# Altium project PCB_Lopta.PrjPcb
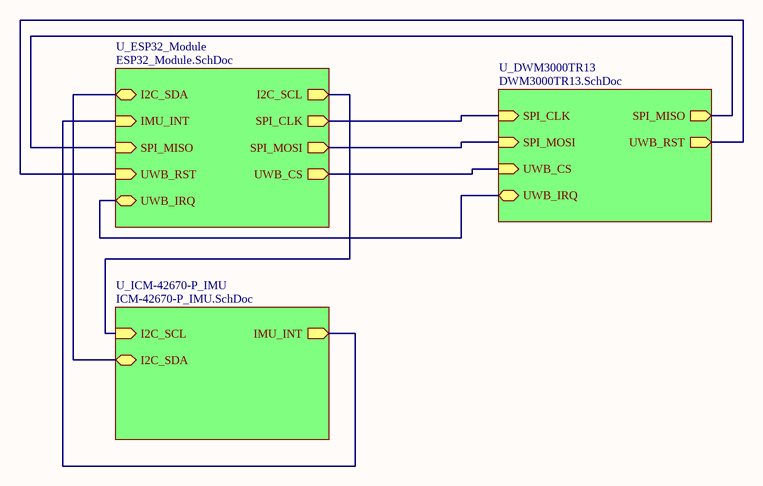
[diagram p0: Main.SchDoc]
4 sheets, 26 parts. Net scope: hierarchical (ports join the sheet entries above them; power ports are global).
Board file: PCB_Ball.PcbDoc
Sheets:
  Main.SchDoc
    U_ESP32_Module = ESP32_Module.SchDoc
    U_DWM3000TR13 = DWM3000TR13.SchDoc
    U_ICM-42670-P_IMU = ICM-42670-P_IMU.SchDoc

## Sheet Main.SchDoc
size A; SheetNumber: 1; SheetTotal: 4

### Sub-sheets
U_DWM3000TR13 = DWM3000TR13.SchDoc: SPI_CLK (in), SPI_MISO (out), SPI_MOSI (in), UWB_CS (in), UWB_RST (out), UWB_IRQ (bidir)
U_ESP32_Module = ESP32_Module.SchDoc: I2C_SCL (out), I2C_SDA (bidir), IMU_INT (in), SPI_CLK (out), SPI_MISO (in), SPI_MOSI (out), UWB_CS (out), UWB_RST (in), UWB_IRQ (bidir)
U_ICM-42670-P_IMU = ICM-42670-P_IMU.SchDoc: I2C_SCL (in), I2C_SDA (bidir), IMU_INT (out)

### Nets
NetMT1_4: sheet U_ESP32_Module/IMU_INT, sheet U_ICM-42670-P_IMU/IMU_INT
NetMT1_13: sheet U_ESP32_Module/I2C_SCL, sheet U_ICM-42670-P_IMU/I2C_SCL
NetMT1_14: sheet U_ESP32_Module/I2C_SDA, sheet U_ICM-42670-P_IMU/I2C_SDA
NetU1_6: sheet U_ESP32_Module/UWB_IRQ, sheet U_DWM3000TR13/UWB_IRQ
NetU1_12: sheet U_ESP32_Module/UWB_RST, sheet U_DWM3000TR13/UWB_RST
NetU1_29: sheet U_ESP32_Module/UWB_CS, sheet U_DWM3000TR13/UWB_CS
NetU1_30: sheet U_ESP32_Module/SPI_CLK, sheet U_DWM3000TR13/SPI_CLK
NetU1_31: sheet U_ESP32_Module/SPI_MISO, sheet U_DWM3000TR13/SPI_MISO
NetU1_37: sheet U_ESP32_Module/SPI_MOSI, sheet U_DWM3000TR13/SPI_MOSI

## Sheet ESP32_Module.SchDoc
size A; SheetNumber: 2; SheetTotal: 4
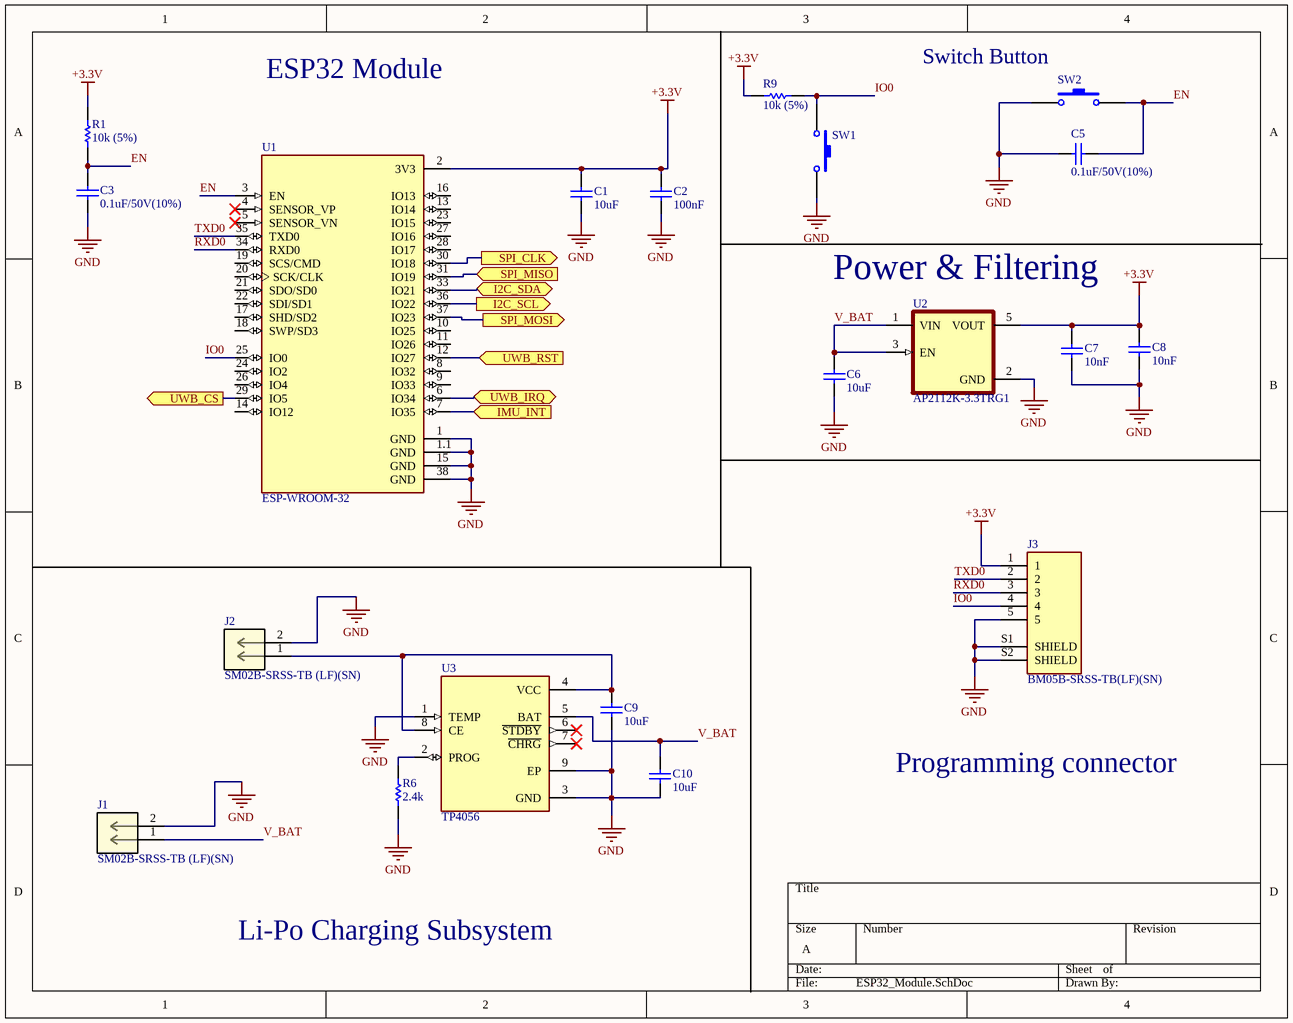
[diagram p1: ESP32_Module.SchDoc]

### Parts
C1  value 10uF  [CAPC1608X90]  (hidden comment: Cap)
C2  value 100nF  [CAPC1005X55N]  (hidden comment: Cap)
C3  value 0.1uF/50V(10%)  [CAPC2012X94N]  (hidden comment: Cap)
C5  value 0.1uF/50V(10%)  [CAPC2012X94N]  (hidden comment: Cap)
C6  value 10uF  [CAPC1608X90]  (hidden comment: Cap)
C7  value 10nF  [CAPC1608X87N]  (hidden comment: Cap)
C8  value 10nF  [CAPC1608X87N]  (hidden comment: Cap)
C9  value 10uF  [CAPC1608X90]  (hidden comment: Cap)
C10  value 10uF  [CAPC1608X90]  (hidden comment: Cap)
J1  SM02B-SRSS-TB (LF)(SN)  [CONN_SM02B-SRSS-TB_JST]
J2  SM02B-SRSS-TB (LF)(SN)  [CONN_SM02B-SRSS-TB_JST]
J3  BM05B-SRSS-TB(LF)(SN)  [JST_BM05B-SRSS-TB(LF)(SN)]
R1  value 10k (5%)  [RESC1005X40]  (hidden comment: Res1)
R6  value 2.4k  [RESC1005X40N]  (hidden comment: Res1)
R9  value 10k (5%)  [RESC1005X40]  (hidden comment: Res1)
SW1  SW-PB  [SW_TL3342F160QG]  (value not drawn)
SW2  SW-PB  [SW_TL3342F160QG]  (value not drawn)
U1  ESP-WROOM-32  [MODULE_ESP-WROOM-32]
U2  AP2112K-3.3TRG1  [SOT95P285X140-5N]
U3  TP4056  [SOP127P600X175-9N]

### Ports
I2C_SCL (out), I2C_SDA (bidir), IMU_INT (in), SPI_CLK (out), SPI_MISO (in), SPI_MOSI (out), UWB_CS (out), UWB_IRQ (bidir), UWB_RST (in)

### Nets
+3.3V: C1.2 C2.2 C7.2 C8.2 J3.1 R1.2 R9.2 U1.2(3V3) U2.5(VOUT)
GND: C1.1 C2.1 C3.1 C5.1 C6.1 C7.1 C8.1 C9.1 C10.1 J1.2 J2.2 J3.5 J3.S1(SHIELD) J3.S2(SHIELD) R6.1 SW1.2 SW2.1 U1.1(GND) U1.1.1(GND) U1.15(GND) U1.38(GND) U2.2(GND) U3.1(TEMP) U3.3(GND) U3.9(EP)
EN: C3.2 C5.2 R1.1 SW2.2 U1.3(EN)
IO0: J3.4 R9.1 SW1.1 U1.25(IO0)
RXD0: J3.3 U1.34(RXD0)
TXD0: J3.2 U1.35(TXD0)
V_BAT: C6.2 C10.2 J1.1 U2.1(VIN) U2.3(EN) U3.5(BAT)
NetC9_2: C9.2 J2.1 U3.4(VCC) U3.8(CE)
NetMT1_4: U1.7(IO35) ; port IMU_INT
NetMT1_13: U1.36(IO22) ; port I2C_SCL
NetMT1_14: U1.33(IO21) ; port I2C_SDA
NetR6_2: R6.2 U3.2(PROG)
NetU1_6: U1.6(IO34) ; port UWB_IRQ
NetU1_12: U1.12(IO27) ; port UWB_RST
NetU1_29: U1.29(IO5) ; port UWB_CS
NetU1_30: U1.30(IO18) ; port SPI_CLK
NetU1_31: U1.31(IO19) ; port SPI_MISO
NetU1_37: U1.37(IO23) ; port SPI_MOSI

Not connected (* = marked no-connect by the designer): U1 4(SENSOR_VP)* 5(SENSOR_VN)* 8(IO32) 9(IO33) 10(IO25) 11(IO26) 13(IO14) 14(IO12) 16(IO13) 17(SHD/SD2) 18(SWP/SD3) 19(SCS/CMD) 20(SCK/CLK) 21(SDO/SD0) 22(SDI/SD1) 23(IO15) 24(IO2) 26(IO4) 27(IO16) 28(IO17); U3 6(~{STDBY})* 7(~{CHRG})*

### Notes on the sheet
- ESP32 Module
- (near SW2) Switch Button
- Power & Filtering
- Programming connector
- Li-Po Charging Subsystem

### Library data of the parts
C1-C3 C5-C10 = Cap: Capacitor; Published: 8-Jun-2000; LatestRevisionDate: 17-Jul-2002; LatestRevisionNote: Re-released for DXP Platform.; PackageReference: RAD-0.3; Publisher: Altium Limited; PackageDescription: Radial Cap, Thru-Hole; 2 Leads; 0.3 in Pin Spacing
J1 J2 = SM02B-SRSS-TB LFSN: Description; Manufacturer_Name: JST; Copyright: Copyright (C) 2026 Ultra Librarian. All rights reserved.; Manufacturer_Part_Number: SM02B-SRSS-TB (LF)(SN); RefDes: RefDes; Type: Type
R1 R6 R9 = Res1: Resistor; Published: 8-Jun-2000; LatestRevisionDate: 17-Jul-2002; LatestRevisionNote: Re-released for DXP Platform.; PackageReference: AXIAL-0.3; Publisher: Altium Limited; PackageDescription: Axial Device, Thru-Hole; 2 Leads; 0.3 in Pin Spacing
SW1 SW2 = SW-PB: Switch; Published: 24-Mar-1999; LatestRevisionDate: 17-Jul-2002; LatestRevisionNote: Re-released for DXP Platform.; PackageReference: SPST-2; Publisher: Altium Limited; PackageDescription: Switch; 2 Leads
U1 = ESP-WROOM-32: Transceptor serie ESP-WROOM-32; Placa de evaluaciÃ³n 802.11 b/g/n (Wi-Fi, WiFi, WLAN), BluetoothÂ® Smart 4.x de bajo consumo (BLE); MF: Espressif Systems; SnapEDA_Link: https://www.snapeda.com/parts/ESP-WROOM-32/Espressif+Systems/view-part/?ref=snap; Package: Module Espressif Systems; Value: *; MP: ESP-WROOM-32; Check_prices: https://www.snapeda.com/parts/ESP-WROOM-32/Espressif+Systems/view-part/?ref=eda
U2 = AP2112K-3.3TRG1: Linear Voltage Regulator IC Positive Fixed 1 Output 600mA SOT-25; MF: Diodes Inc.; Value: *; Purchase-URL: https://pricing.snapeda.com/search/part/AP2112K-3.3TRG1/?ref=eda; Package: SOT-753 Diodes Inc.; Availability: In Stock; Check_prices: https://www.snapeda.com/parts/AP2112K-3.3TRG1/Diodes+Inc./view-part/?ref=eda; Price: None; SnapEDA_Link: https://www.snapeda.com/parts/AP2112K-3.3TRG1/Diodes+Inc./view-part/?ref=snap; MP: AP2112K-3.3TRG1
U3 = TP4056: Complete single cell Li-Ion battery with a constant current / constant voltage linear charger; MF: NanJing Top Power ASIC Corp.; Check_prices: https://www.snapeda.com/parts/TP4056/NanJing+Top+Power+ASIC+Corp./view-part/?ref=eda; SnapEDA_Link: https://www.snapeda.com/parts/TP4056/NanJing+Top+Power+ASIC+Corp./view-part/?ref=snap; Price: None; Availability: Not in stock; Package: Package; MP: TP4056; Value: *
J3 = BM05B-SRSS-TB(LF)(SN): Package: None; Price: None; Value: *; MP: BM05B-SRSS-TB(LF)(SN); Availability: Unavailable

## Sheet DWM3000TR13.SchDoc
size A; SheetNumber: 4; SheetTotal: 4
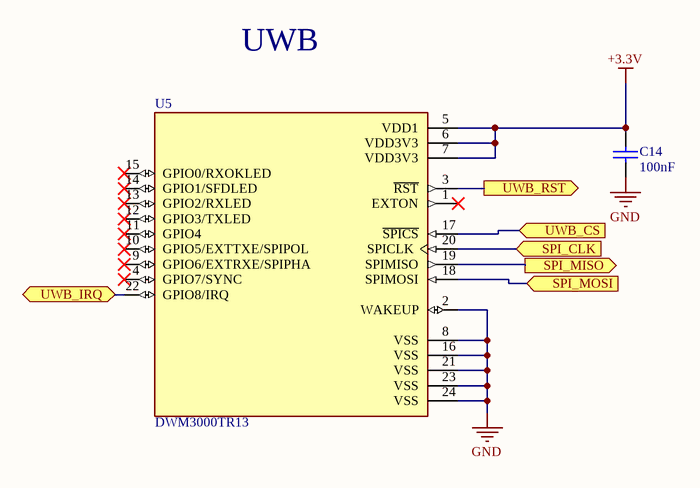
[diagram p2: DWM3000TR13.SchDoc]

### Parts
C14  value 100nF  [CAPC1005X55N]  (hidden comment: Cap)
U5  DWM3000TR13  [XCVR_DWM3000TR13]

### Ports
SPI_CLK (in), SPI_MISO (out), SPI_MOSI (in), UWB_CS (in), UWB_IRQ (bidir), UWB_RST (out)

### Nets
+3.3V: C14.2 U5.5(VDD1) U5.6(VDD3V3) U5.7(VDD3V3)
GND: C14.1 U5.2(WAKEUP) U5.8(VSS) U5.16(VSS) U5.21(VSS) U5.23(VSS) U5.24(VSS)
NetU1_6: U5.22(GPIO8/IRQ) ; port UWB_IRQ
NetU1_12: U5.3(~{RST}) ; port UWB_RST
NetU1_29: U5.17(~{SPICS}) ; port UWB_CS
NetU1_30: U5.20(SPICLK) ; port SPI_CLK
NetU1_31: U5.19(SPIMISO) ; port SPI_MISO
NetU1_37: U5.18(SPIMOSI) ; port SPI_MOSI

Not connected (* = marked no-connect by the designer): U5 1(EXTON)* 4(GPIO7/SYNC)* 9(GPIO6/EXTRXE/SPIPHA)* 10(GPIO5/EXTTXE/SPIPOL)* 11(GPIO4)* 12(GPIO3/TXLED)* 13(GPIO2/RXLED)* 14(GPIO1/SFDLED)* 15(GPIO0/RXOKLED)*

### Notes on the sheet
- UWB

### Library data of the parts
C14 = Cap: Capacitor; Published: 8-Jun-2000; LatestRevisionDate: 17-Jul-2002; LatestRevisionNote: Re-released for DXP Platform.; PackageReference: RAD-0.3; Publisher: Altium Limited; PackageDescription: Radial Cap, Thru-Hole; 2 Leads; 0.3 in Pin Spacing
U5 = DWM3000TR13: 802.15.4, Bluetooth, Cellular UWB, ZigbeeÂ® Transceiver Module 6.25GHz ~ 8.25GHz Integrated, Ceramic Patch Surface Mount; MF: Qorvo; SnapEDA_Link: https://www.snapeda.com/parts/DWM3000TR13/Qorvo/view-part/?ref=snap; Package: None; Value: *; MP: DWM3000TR13; Check_prices: https://www.snapeda.com/parts/DWM3000TR13/Qorvo/view-part/?ref=eda

## Sheet ICM-42670-P_IMU.SchDoc
size A; SheetNumber: 3; SheetTotal: 4
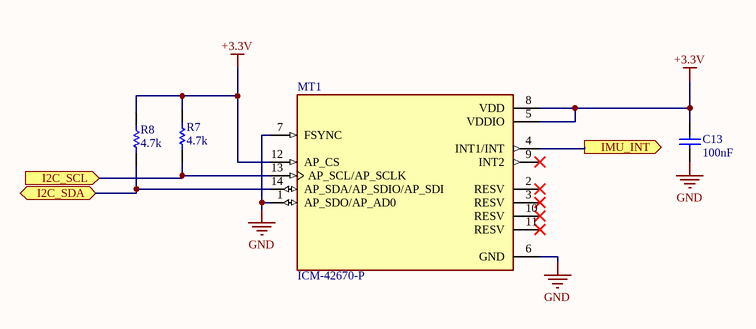
[diagram p3: ICM-42670-P_IMU.SchDoc]

### Parts
C13  value 100nF  [CAPC1005X55N]  (hidden comment: Cap)
MT1  ICM-42670-P  [XDCR_ICM-42670-P]
R7  value 4.7k  [RESC1005X40]  (hidden comment: Res1)
R8  value 4.7k  [RESC1005X40]  (hidden comment: Res1)

### Ports
I2C_SCL (in), I2C_SDA (bidir), IMU_INT (out)

### Nets
+3.3V: C13.2 MT1.5(VDDIO) MT1.8(VDD) MT1.12(AP_CS) R7.2 R8.2
GND: C13.1 MT1.1(AP_SDO/AP_AD0) MT1.6(GND) MT1.7(FSYNC)
NetMT1_4: MT1.4(INT1/INT) ; port IMU_INT
NetMT1_13: MT1.13(AP_SCL/AP_SCLK) R7.1 ; port I2C_SCL
NetMT1_14: MT1.14(AP_SDA/AP_SDIO/AP_SDI) R8.1 ; port I2C_SDA

Not connected (* = marked no-connect by the designer): MT1 2(RESV)* 3(RESV)* 9(INT2)* 10(RESV)* 11(RESV)*

### Library data of the parts
C13 = Cap: Capacitor; Published: 8-Jun-2000; LatestRevisionDate: 17-Jul-2002; LatestRevisionNote: Re-released for DXP Platform.; PackageReference: RAD-0.3; Publisher: Altium Limited; PackageDescription: Radial Cap, Thru-Hole; 2 Leads; 0.3 in Pin Spacing
R7 R8 = Res1: Resistor; Published: 8-Jun-2000; LatestRevisionDate: 17-Jul-2002; LatestRevisionNote: Re-released for DXP Platform.; PackageReference: AXIAL-0.3; Publisher: Altium Limited; PackageDescription: Axial Device, Thru-Hole; 2 Leads; 0.3 in Pin Spacing
MT1 = ICM-42670-P: Package: None; Price: None; Value: *; MP: ICM-42670-P; Availability: Unavailable

## Nets that join several sheets
+3.3V: ESP32_Module (9 pins), DWM3000TR13 (C14.2 U5.5 U5.6 U5.7), ICM-42670-P_IMU (6 pins)
GND: ESP32_Module (25 pins), DWM3000TR13 (7 pins), ICM-42670-P_IMU (C13.1 MT1.1 MT1.6 MT1.7)
NetMT1_4: ESP32_Module (U1.7), ICM-42670-P_IMU (MT1.4)
NetMT1_13: ESP32_Module (U1.36), ICM-42670-P_IMU (MT1.13 R7.1)
NetMT1_14: ESP32_Module (U1.33), ICM-42670-P_IMU (MT1.14 R8.1)
NetU1_6: ESP32_Module (U1.6), DWM3000TR13 (U5.22)
NetU1_12: ESP32_Module (U1.12), DWM3000TR13 (U5.3)
NetU1_29: ESP32_Module (U1.29), DWM3000TR13 (U5.17)
NetU1_30: ESP32_Module (U1.30), DWM3000TR13 (U5.20)
NetU1_31: ESP32_Module (U1.31), DWM3000TR13 (U5.19)
NetU1_37: ESP32_Module (U1.37), DWM3000TR13 (U5.18)